# Altium project Compact Inverter Power.PrjPcb
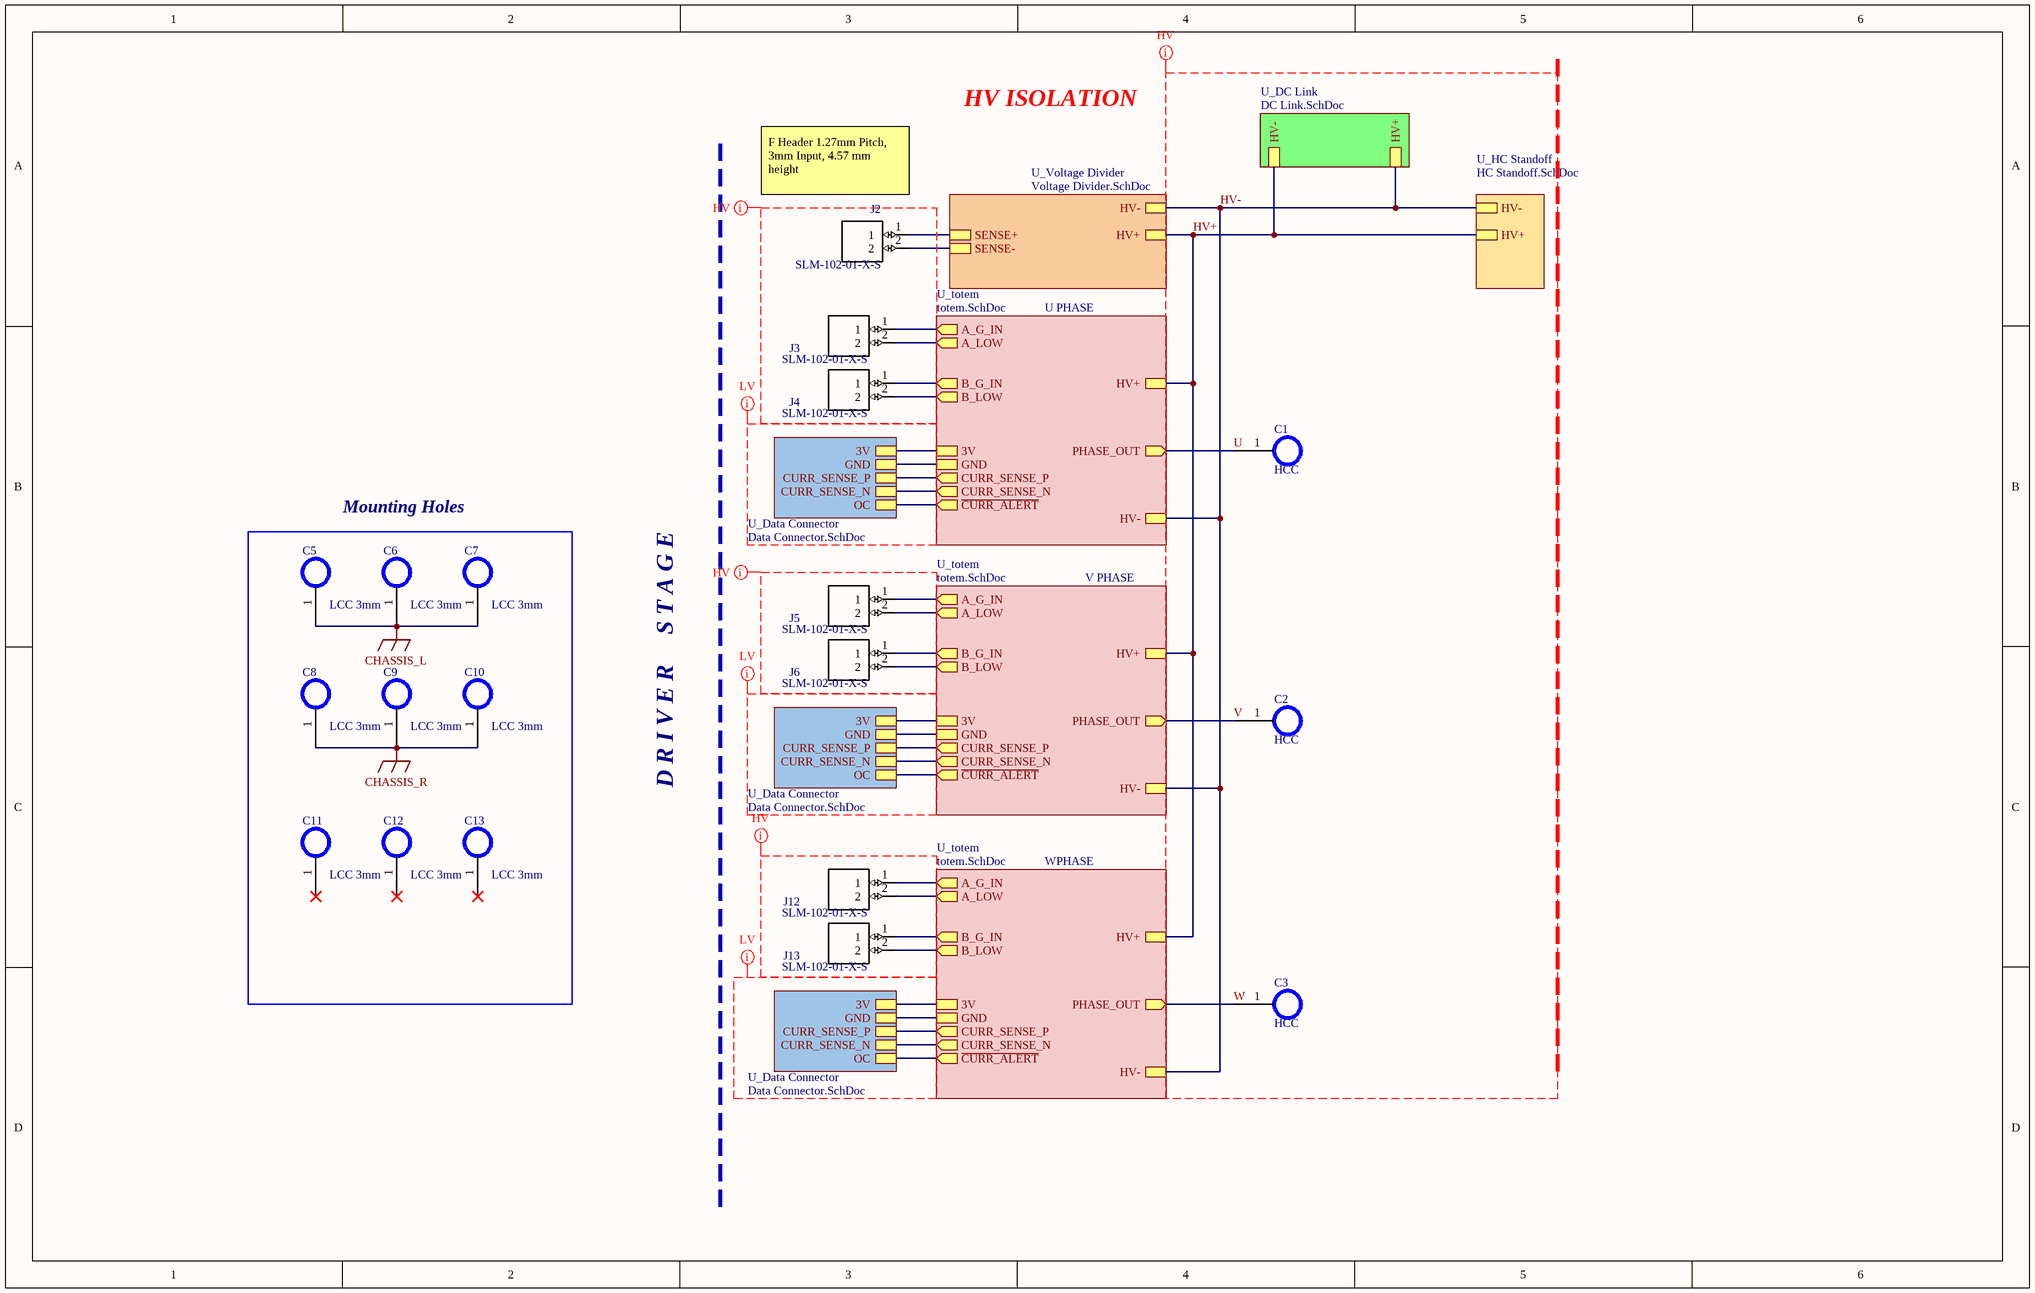
[diagram p0: Tree.SchDoc]
Model: 24
5 sheets, 78 parts. Net scope: strictly hierarchical (ports join the sheet entries above them; power ports are local).
Board file: PCB.PcbDoc
Sheets:
  Tree.SchDoc
    U_HC Standoff = HC Standoff.SchDoc
    U_DC Link = DC Link.SchDoc
    U_Data Connector = Data Connector.SchDoc
    U_totem = totem.SchDoc
    U_Data Connector = Data Connector.SchDoc
    U_totem = totem.SchDoc
    U_Data Connector = Data Connector.SchDoc
    U_totem = totem.SchDoc

## Sheet Tree.SchDoc
size B; SheetNumber: 1; SheetTotal: 6

### Parts
(Parts that share a designator on the sheet are numbered #1, #2 ... from top to bottom, then left to right.)
C1  HCC  [6mm Pad]
C2  HCC  [6mm Pad]
C3  HCC  [6mm Pad]
C5  LCC 3mm  [PAD 3MM]
C6  LCC 3mm  [PAD 3MM]
C7  LCC 3mm  [PAD 3MM]
C8  LCC 3mm  [PAD 3MM]
C9  LCC 3mm  [PAD 3MM]
C10  LCC 3mm  [PAD 3MM]
C11#1  LCC 3mm  [PAD 3MM]
C12#1  LCC 3mm  [PAD 3MM]
C13#1  LCC 3mm  [PAD 3MM]
J2  SLM-102-01-X-S  [*SLM-102-01-X-S]
J3  SLM-102-01-X-S  [*SLM-102-01-X-S]
J4  SLM-102-01-X-S  [*SLM-102-01-X-S]
J5  SLM-102-01-X-S  [*SLM-102-01-X-S]
J6  SLM-102-01-X-S  [*SLM-102-01-X-S]
J12  SLM-102-01-X-S  [*SLM-102-01-X-S]
J13  SLM-102-01-X-S  [*SLM-102-01-X-S]

### Blocks framed on the sheet
Mounting Holes: C5-C10 C11#1 C12#1 C13#1

### Sub-sheets
U_Data Connector = Data Connector.SchDoc: GND, OC, 3V, CURR_SENSE_P, CURR_SENSE_N
U_Data Connector = Data Connector.SchDoc: GND, OC, 3V, CURR_SENSE_P, CURR_SENSE_N
U_Data Connector = Data Connector.SchDoc: GND, OC, 3V, CURR_SENSE_P, CURR_SENSE_N
U_DC Link = DC Link.SchDoc: HV+, HV-
U_HC Standoff = HC Standoff.SchDoc: HV+, HV-
U_totem = totem.SchDoc: PHASE_OUT (out), B_LOW (out), B_G_IN (out), A_LOW (out), A_G_IN (out), ~{CURR_ALERT} (out), HV+, HV-, 3V, GND, CURR_SENSE_P (out), CURR_SENSE_N (out)
U_totem = totem.SchDoc: PHASE_OUT (out), B_LOW (out), B_G_IN (out), A_LOW (out), A_G_IN (out), ~{CURR_ALERT} (out), HV+, HV-, 3V, GND, CURR_SENSE_P (out), CURR_SENSE_N (out)
U_totem = totem.SchDoc: PHASE_OUT (out), B_LOW (out), B_G_IN (out), A_LOW (out), A_G_IN (out), ~{CURR_ALERT} (out), HV+, HV-, 3V, GND, CURR_SENSE_P (out), CURR_SENSE_N (out)
U_Voltage Divider = Voltage Divider.SchDoc (file not in this document): HV+, HV-, SENSE+, SENSE-  | ClassName: U PHASE

### Nets
3V: sheet U_Data Connector/3V, sheet U_totem/3V
3V: sheet U_Data Connector/3V, sheet U_totem/3V  [a separate net that carries the same name]
3V: sheet U_Data Connector/3V, sheet U_totem/3V  [a separate net that carries the same name]
CHASSIS_L: C5.1 C6.1 C7.1
CHASSIS_R: C8.1 C9.1 C10.1
GND: sheet U_Data Connector/GND, sheet U_totem/GND
GND: sheet U_Data Connector/GND, sheet U_totem/GND  [a separate net that carries the same name]
GND: sheet U_Data Connector/GND, sheet U_totem/GND  [a separate net that carries the same name]
~{OC_DET}: sheet U_Data Connector/OC, sheet U_totem/~{CURR_ALERT}
~{OC_DET}: sheet U_Data Connector/OC, sheet U_totem/~{CURR_ALERT}  [a separate net that carries the same name]
~{OC_DET}: sheet U_Data Connector/OC, sheet U_totem/~{CURR_ALERT}  [a separate net that carries the same name]
A_G_IN: J3.1 ; sheet U_totem/A_G_IN
A_G_IN: J5.1 ; sheet U_totem/A_G_IN  [a separate net that carries the same name]
A_G_IN: J12.1 ; sheet U_totem/A_G_IN  [a separate net that carries the same name]
A_LOW: J3.2 ; sheet U_totem/A_LOW
A_LOW: J5.2 ; sheet U_totem/A_LOW  [a separate net that carries the same name]
A_LOW: J12.2 ; sheet U_totem/A_LOW  [a separate net that carries the same name]
B_G_IN: J4.1 ; sheet U_totem/B_G_IN
B_G_IN: J6.1 ; sheet U_totem/B_G_IN  [a separate net that carries the same name]
B_G_IN: J13.1 ; sheet U_totem/B_G_IN  [a separate net that carries the same name]
B_LOW: J4.2 ; sheet U_totem/B_LOW
B_LOW: J6.2 ; sheet U_totem/B_LOW  [a separate net that carries the same name]
B_LOW: J13.2 ; sheet U_totem/B_LOW  [a separate net that carries the same name]
CURR_SENSE_N: sheet U_Data Connector/CURR_SENSE_N, sheet U_totem/CURR_SENSE_N
CURR_SENSE_N: sheet U_Data Connector/CURR_SENSE_N, sheet U_totem/CURR_SENSE_N  [a separate net that carries the same name]
CURR_SENSE_N: sheet U_Data Connector/CURR_SENSE_N, sheet U_totem/CURR_SENSE_N  [a separate net that carries the same name]
CURR_SENSE_P: sheet U_Data Connector/CURR_SENSE_P, sheet U_totem/CURR_SENSE_P
CURR_SENSE_P: sheet U_Data Connector/CURR_SENSE_P, sheet U_totem/CURR_SENSE_P  [a separate net that carries the same name]
CURR_SENSE_P: sheet U_Data Connector/CURR_SENSE_P, sheet U_totem/CURR_SENSE_P  [a separate net that carries the same name]
HV+: sheet U_HC Standoff/HV+, sheet U_Voltage Divider/HV+, sheet U_DC Link/HV-, sheet U_totem/HV+, sheet U_totem/HV+, sheet U_totem/HV+
HV-: sheet U_HC Standoff/HV-, sheet U_Voltage Divider/HV-, sheet U_DC Link/HV+, sheet U_totem/HV-, sheet U_totem/HV-, sheet U_totem/HV-
U: C1.1 ; sheet U_totem/PHASE_OUT
V: C2.1 ; sheet U_totem/PHASE_OUT
W: C3.1 ; sheet U_totem/PHASE_OUT
NetJ2_1: J2.1 ; sheet U_Voltage Divider/SENSE+
NetJ2_2: J2.2 ; sheet U_Voltage Divider/SENSE-

Not connected (* = marked no-connect by the designer): C11#1 1*; C12#1 1*; C13#1 1*

### Layout directives
net class HV: (no net found under the mark), HV+, HV-, U, V, W
net class LV: (no net found under the mark)

### Notes on the sheet
- HV ISOLATION
- (near J2) F Header 1.27mm Pitch, 3mm Input, 4.57 mm height
- U PHASE
- V PHASE
- D R I V E R     S T A G E
- WPHASE
- MY
- Project
- Author
- Revision
- Sheet
- Modified
- of

### Library data of the parts
J2-J6 J12 J13 = SLM-102-01-X-S: Value: *

## Sheet HC Standoff.SchDoc
size A; SheetNumber: 4; SheetTotal: 4
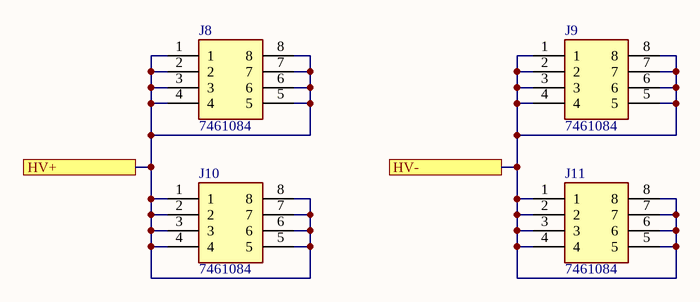
[diagram p1: HC Standoff.SchDoc]

### Parts
J8  7461084  [7461084]
J9  7461084  [7461084]
J10  7461084  [7461084]
J11  7461084  [7461084]

### Ports
HV+, HV-

### Nets
HV+: J8.1 J8.2 J8.3 J8.4 J8.5 J8.6 J8.7 J8.8 J10.1 J10.2 J10.3 J10.4 J10.5 J10.6 J10.7 J10.8 ; port HV+
HV-: J9.1 J9.2 J9.3 J9.4 J9.5 J9.6 J9.7 J9.8 J11.1 J11.2 J11.3 J11.4 J11.5 J11.6 J11.7 J11.8 ; port HV-

### Library data of the parts
J8-J11 = 7461084: Connector; Manufacturer_Name: Wurth Elektronik; Datasheet Link: https://www.we-online.com/components/products/datasheet/7461084.pdf; Height: 13.5mm; Manufacturer_Part_Number: 7461084; Mouser Part Number: 710-7461084; Mouser Price/Stock: https://www.mouser.co.uk/ProductDetail/Wurth-Elektronik/7461084?qs=lykWx4dhCCHlOeuPuO4BAQ%3D%3D

## Sheet DC Link.SchDoc
size A; SheetNumber: 6; SheetTotal: 7
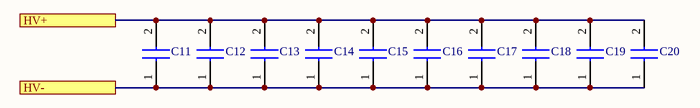
[diagram p2: DC Link.SchDoc]

### Parts
(Parts that share a designator on the sheet are numbered #1, #2 ... from top to bottom, then left to right.)
C11#2  B58031U9254M062  [B58031U9254M062]  (value not drawn)
C12#2  B58031U9254M062  [B58031U9254M062]  (value not drawn)
C13#2  B58031U9254M062  [B58031U9254M062]  (value not drawn)
C14  B58031U9254M062  [B58031U9254M062]  (value not drawn)
C15  B58031U9254M062  [B58031U9254M062]  (value not drawn)
C16  B58031U9254M062  [B58031U9254M062]  (value not drawn)
C17  B58031U9254M062  [B58031U9254M062]  (value not drawn)
C18  B58031U9254M062  [B58031U9254M062]  (value not drawn)
C19  B58031U9254M062  [B58031U9254M062]  (value not drawn)
C20  B58031U9254M062  [B58031U9254M062]  (value not drawn)

### Ports
HV+, HV-

### Nets
HV+: C11#2.1 C12#2.1 C13#2.1 C14.1 C15.1 C16.1 C17.1 C18.1 C19.1 C20.1 ; port HV-
HV-: C11#2.2 C12#2.2 C13#2.2 C14.2 C15.2 C16.2 C17.2 C18.2 C19.2 C20.2 ; port HV+

### Library data of the parts
C11#2 C12#2 C13#2 C14-C20 = B58031U9254M062: Capacitor; Manufacturer_Name: TDK; Datasheet Link: https://product.tdk.com/system/files/dam/doc/product/capacitor/ceramic/ceralink/data_sheet/20/10/ds/b58031_lp.pdf; Height: 4.5mm; Manufacturer_Part_Number: B58031U9254M062; Mouser Part Number: 871-B58031U9254M062; Mouser Price/Stock: https://www.mouser.co.uk/ProductDetail/EPCOS-TDK/B58031U9254M062?qs=Mv7BduZupUir5egwM6Ifng%3D%3D; Arrow Part Number: B58031U9254M062; Arrow Price/Stock: https://www.arrow.com/en/products/b58031u9254m062/tdk?region=europe

## Sheet Data Connector.SchDoc
size A; SheetNumber: 3; SheetTotal: 6
Used 3 times, as channels U_Data Connector, U_Data Connector, U_Data Connector. Parts and nets are listed once, with the designators drawn on the sheet.
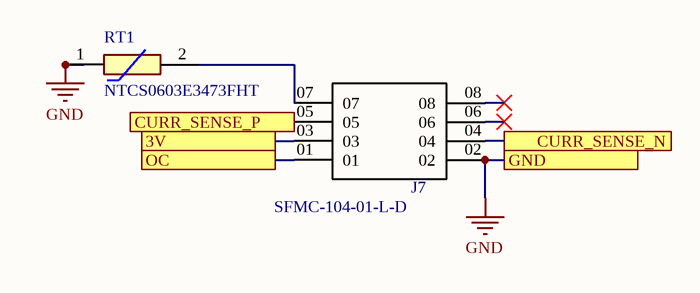
[diagram p3: Data Connector.SchDoc]

### Parts
J7  SFMC-104-01-L-D  [*SAMTEC_SFMC-104-01-L-D_SFMC-104-01-L-D(Primary)]
RT1  NTCS0603E3473FHT  [THRMC1608X95N]

### Ports
3V, CURR_SENSE_N, CURR_SENSE_P, GND, OC

### Nets
GND: J7.02 RT1.1 ; port GND
3V: J7.03 ; port 3V
CURR_SENSE_N: J7.04 ; port CURR_SENSE_N
CURR_SENSE_P: J7.05 ; port CURR_SENSE_P
OC: J7.01 ; port OC
NetJ7_07: J7.07 RT1.2

Not connected (* = marked no-connect by the designer): J7 06* 08*

### Channels
U_Data Connector: designators end in _U_Data_Connector#1; ports 3V=3V CURR_SENSE_N=CURR_SENSE_N CURR_SENSE_P=CURR_SENSE_P GND=GND OC=~{OC_DET}
U_Data Connector: designators end in _U_Data_Connector#2; ports 3V=3V CURR_SENSE_N=CURR_SENSE_N CURR_SENSE_P=CURR_SENSE_P GND=GND OC=~{OC_DET}
U_Data Connector: designators end in _U_Data_Connector#3; ports 3V=3V CURR_SENSE_N=CURR_SENSE_N CURR_SENSE_P=CURR_SENSE_P GND=GND OC=~{OC_DET}

### Library data of the parts
RT1 = NTCS0603E3473FHT: Thermistor; Manufacturer_Name: Vishay; Datasheet Link: https://datasheet.datasheetarchive.com/originals/distributors/Datasheets-DGA6/547972.pdf; Height: 0.95mm; Manufacturer_Part_Number: NTCS0603E3473FHT; Mouser Part Number: 594-NTCS0603E3473FHT; Mouser Price/Stock: https://www.mouser.co.uk/ProductDetail/Vishay-BC-Components/NTCS0603E3473FHT?qs=%2FWiulJ9oly5JyPnR8jCnHg%3D%3D; Arrow Part Number: NTCS0603E3473FHT; Arrow Price/Stock: https://www.arrow.com/en/products/ntcs0603e3473fht/vishay
J7 = SFMC-104-01-L-D: Value: *

## Sheet totem.SchDoc
size A4; SheetNumber: 2; SheetTotal: 6
Used 3 times, as channels U_totem, U_totem, U_totem. Parts and nets are listed once, with the designators drawn on the sheet.
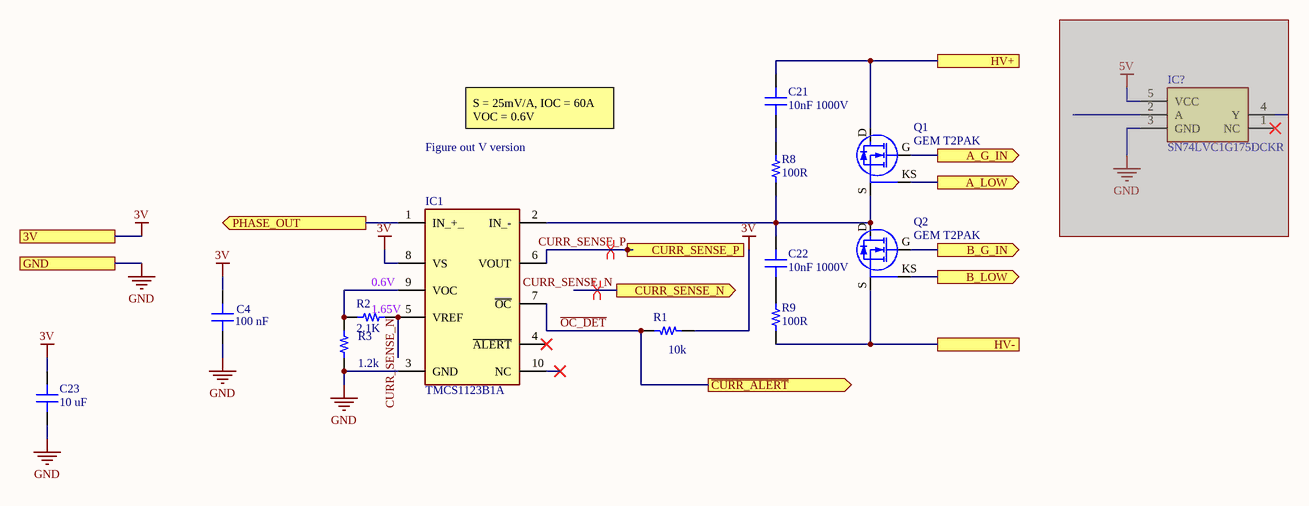
[diagram p4: totem.SchDoc]

### Parts
C4  Capacitance: 100 nF  [CAP 0603_1608]  (hidden comment: 20 pF)
C21  10nF 1000V  [CAP 1206_3216 - 0.8MM]
C22  10nF 1000V  [CAP 1206_3216 - 0.8MM]
C23  Capacitance: 10 uF  [CAP 0603_1608]  (hidden comment: 20 pF)
IC1  TMCS1123B1A  [TMCS1126A8AQDVGRQ1]
IC?  SN74LVC1G175DCKR  [SOP65P210X110-6N]  (masked out: inside a compile mask, not in the netlist)
Q1  GEM T2PAK  [GEM T2PAK H3.6]
Q2  GEM T2PAK  [GEM T2PAK H3.6]
R1  10k  [RES 0603_1608]
R2  2.1K  [RES 0603_1608]
R3  1.2k  [RES 0603_1608]
R8  100R  [RES 1206_3216]
R9  100R  [RES 1206_3216]

### Ports
3V, A_G_IN (out), A_LOW (out), B_G_IN (out), B_LOW (out), CURR_SENSE_N (out), CURR_SENSE_P (out), GND, HV+, HV-, PHASE_OUT (out), ~{CURR_ALERT} (out)

### Nets
3V: C4.1 C23.1 IC1.8(VS) R1.2 ; port 3V
GND: C4.2 C23.2 IC1.3(GND) R3.2 ; port GND
~{OC_DET}: IC1.7(~{OC}) R1.1 ; port ~{CURR_ALERT}
A_G_IN: Q1.G ; port A_G_IN
A_LOW: Q1.KS ; port A_LOW
B_G_IN: Q2.G ; port B_G_IN
B_LOW: Q2.KS ; port B_LOW
CURR_SENSE_N: IC1.5(VREF) R2.2 ; port CURR_SENSE_N
CURR_SENSE_P: IC1.6(VOUT) ; port CURR_SENSE_P
HV+: C21.2 Q1.D ; port HV+
HV-: Q2.S R9.1 ; port HV-
PHASE_OUT: IC1.1(IN_+_) ; port PHASE_OUT
NetC21_1: C21.1 R8.2
NetC22_1: C22.1 R9.2
NetC22_2: C22.2 IC1.2(IN_-) Q1.S Q2.D R8.1
NetIC1_9: IC1.9(VOC) R2.1 R3.1

Not connected (* = marked no-connect by the designer): IC1 4(~{ALERT})* 10(NC)*

### Channels
U_totem: designators end in _U_totem#1; ports 3V=3V A_G_IN=A_G_IN A_LOW=A_LOW B_G_IN=B_G_IN B_LOW=B_LOW CURR_SENSE_N=CURR_SENSE_N CURR_SENSE_P=CURR_SENSE_P GND=GND HV+=HV+ HV-=HV- PHASE_OUT=U ~{CURR_ALERT}=~{OC_DET}
U_totem: designators end in _U_totem#2; ports 3V=3V A_G_IN=A_G_IN A_LOW=A_LOW B_G_IN=B_G_IN B_LOW=B_LOW CURR_SENSE_N=CURR_SENSE_N CURR_SENSE_P=CURR_SENSE_P GND=GND HV+=HV+ HV-=HV- PHASE_OUT=V ~{CURR_ALERT}=~{OC_DET}
U_totem: designators end in _U_totem#3; ports 3V=3V A_G_IN=A_G_IN A_LOW=A_LOW B_G_IN=B_G_IN B_LOW=B_LOW CURR_SENSE_N=CURR_SENSE_N CURR_SENSE_P=CURR_SENSE_P GND=GND HV+=HV+ HV-=HV- PHASE_OUT=W ~{CURR_ALERT}=~{OC_DET}

### Layout directives
differential pair: CURR_SENSE_N, CURR_SENSE_P

### Notes on the sheet
- S = 25mV/A, IOC = 60A
  VOC = 0.6V
- Figure out V version
- (near R2) 1.65V
- 0.6V
- MY
- 25
- Project:
- Author
- Revision
- Sheet
- Modified
- of

### Library data of the parts
C4 C23 = C0603C200K5GAC7867: CAP CER 20PF 50V NP0 0603; manufacturer: KEMET; Temperature Coefficient: C0G, NP0; Tolerance: ±10%; Part Number: C0603C200K5GAC7867; Applications: General Purpose; componentlink1description: Datasheet; componentlink1url: https://api.kemet.com/component-edge/download/datasheet/C0603C200K5GACTU.pdf; componentlink2description: DigiKey Link; componentlink2url: https://www.digikey.com/en/products/detail/kemet/C0603C200K5GAC7867/2200149; Device Package: 0603 (1608 Metric); Features: Low ESL; lastupdated: 2/9/2024 8:10:26 PM; Lifecycle Status: Active; Minimum Order: 1; Mounting Type: Surface Mount, MLCC; Operating Temperature: -55°C ~ 125°C; Package / Case: 0603 (1608 Metric); packaging: TapeAndReel; partid: 5330; Part Status: Active; price: 0.04; series: SMD Comm C0G; Size / Dimension: 0.063" L x 0.031" W (1.60mm x 0.80mm); Supplier 1: DigiKey; Supplier Part Number 1: 399-17401-1-ND; Thickness (Max): 0.034" (0.87mm); value: 20 pF; Voltage - Rated: 50V
C21 C22 = MM062C102KCZ2A: CAP CER 1000PF 200V X7R 1206; manufacturer: AVX Corporation; Tolerance: ±10%; Part Number: MM062C102KCZ2A; Capacitance: 1000pF; Applications: Medical, Non-Critical; componentlink1description: Datasheet; componentlink1url: http://datasheets.avx.com/AVX-MM.pdf; componentlink2description: DigiKey Link; componentlink2url: http://digikey.com/product-detail/en/avx-corporation/MM062C102KCZ2A/478-10625-1-ND/7344886; Device Package: 1206 (3216 Metric); lastupdated: 9/2/2020 1:04:46 AM; Lifecycle Status: Active; Minimum Order: 1; Mounting Type: Surface Mount, MLCC; Operating Temperature: -55°C ~ 125°C; Package / Case: 1206 (3216 Metric); packaging: TapeAndReel; partid: 18686; Part Status: Active; price: 0.57; series: MM; Size / Dimension: 0.126" L x 0.063" W (3.20mm x 1.60mm); Supplier 1: DigiKey; Supplier Part Number 1: 478-10625-1-ND; Temperature Coefficient: X7R; Thickness (Max): 0.029" (0.74mm); value: 1000pF; Voltage - Rated: 200V
IC1 = TMCS1123A1AQDVGR: Integrated Circuit; Manufacturer_Name: Texas Instruments; Datasheet Link: https://www.ti.com/lit/ds/symlink/tmcs1123.pdf?ts=1707973672803&ref_url=https%253A%252F%252Fwww.google.com%252F; Height: 2.65mm; Manufacturer_Part_Number: TMCS1123A1AQDVGR; Mouser Part Number: 595-TMCS1123A1AQDVGR; Mouser Price/Stock: https://www.mouser.co.uk/ProductDetail/Texas-Instruments/TMCS1123A1AQDVGR?qs=mELouGlnn3ezMP2QpzrvaA%3D%3D; Arrow Part Number: TMCS1123A1AQDVGR; Arrow Price/Stock: https://www.arrow.com/en/products/tmcs1123a1aqdvgr/texas-instruments?region=nac
IC? = SN74LVC1G175DCKR: Integrated Circuit; Manufacturer_Name: Texas Instruments; Datasheet Link: http://www.ti.com/lit/gpn/sn74lvc1g175; Height: 1.1mm; Manufacturer_Part_Number: SN74LVC1G175DCKR; Mouser Part Number: 595-SN74LVC1G175DCKR; Mouser Price/Stock: https://www.mouser.co.uk/ProductDetail/Texas-Instruments/SN74LVC1G175DCKR?qs=pajgIaoyDUjI2BH1x6CpqQ%3D%3D; Arrow Part Number: SN74LVC1G175DCKR; Arrow Price/Stock: https://www.arrow.com/en/products/sn74lvc1g175dckr/texas-instruments?region=nac
R1 = RNCS0603BKE10K0: RES 10K OHM 0.1% 1/16W 0603; Manufacturer: Stackpole Electronics Inc; Value: 1k; Power (Watts): 0.063W, 1/16W; Resistance: 10 kOhms; Temperature Coefficient: ±25ppm/°C; Part Number: RNCS0603BKE10K0; ComponentLink1Description: Datasheet; ComponentLink1URL: https://www.seielect.com/catalog/sei-rncs_rnch.pdf; ComponentLink2Description: DigiKey Link; ComponentLink2URL: https://www.digikey.com/en/products/detail/stackpole-electronics-inc/RNCS0603BKE10K0/1708836; Composition: Thin Film; Device Package: 0603 (1608 Metric); Features: Anti-Corrosive, Automotive AEC-Q200, Moisture Resistant; Height - Seated (Max): 0.022" (0.55mm); LastUpdated: 2/9/2024 8:43:37 PM; Lifecycle Status: Active; Minimum Order: 1; Number of Terminations: 2; Operating Temperature: -55°C ~ 155°C; Package / Case: 0603 (1608 Metric); Packaging: TapeAndReel; PartId: 4838; Part Status: Active; Price: 0.06; Ratings: AEC-Q200; Series: RNCS; Size / Dimension: 0.061" L x 0.031" W (1.55mm x 0.80mm); Supplier 1: DigiKey; Supplier Part Number 1: RNCS0603BKE10K0CT-ND; Supplier Device Package: 0603; Tolerance: ±0.1%
R2 = RNCS0603BKE7K50: RES 7.5K OHM 0.1% 1/16W 0603; Manufacturer: Stackpole Electronics Inc; Power (Watts): 0.063W, 1/16W; Resistance: 7.5 kOhms; Temperature Coefficient: ±25ppm/°C; Part Number: RNCS0603BKE7K50; Value: 2.1K; ComponentLink1Description: Datasheet; ComponentLink1URL: https://www.seielect.com/catalog/sei-rncs_rnch.pdf; ComponentLink2Description: DigiKey Link; ComponentLink2URL: https://www.digikey.com/en/products/detail/stackpole-electronics-inc/RNCS0603BKE7K50/1800055; Composition: Thin Film; Device Package: 0603 (1608 Metric); Features: Anti-Corrosive, Automotive AEC-Q200, Moisture Resistant; Height - Seated (Max): 0.022" (0.55mm); LastUpdated: 2/9/2024 8:43:37 PM; Lifecycle Status: Active; Minimum Order: 1; Number of Terminations: 2; Operating Temperature: -55°C ~ 155°C; Package / Case: 0603 (1608 Metric); Packaging: TapeAndReel; PartId: 4846; Part Status: Active; Price: 0.06; Ratings: AEC-Q200; Series: RNCS; Size / Dimension: 0.061" L x 0.031" W (1.55mm x 0.80mm); Supplier 1: DigiKey; Supplier Part Number 1: RNCS0603BKE7K50CT-ND; Supplier Device Package: 0603; Tolerance: ±0.1%
R3 = RNCS0603BKE10K0: RES 10K OHM 0.1% 1/16W 0603; Manufacturer: Stackpole Electronics Inc; Power (Watts): 0.063W, 1/16W; Resistance: 10 kOhms; Temperature Coefficient: ±25ppm/°C; Part Number: RNCS0603BKE10K0; Value: 10k; ComponentLink1Description: Datasheet; ComponentLink1URL: https://www.seielect.com/catalog/sei-rncs_rnch.pdf; ComponentLink2Description: DigiKey Link; ComponentLink2URL: https://www.digikey.com/en/products/detail/stackpole-electronics-inc/RNCS0603BKE10K0/1708836; Composition: Thin Film; Device Package: 0603 (1608 Metric); Features: Anti-Corrosive, Automotive AEC-Q200, Moisture Resistant; Height - Seated (Max): 0.022" (0.55mm); LastUpdated: 2/9/2024 8:43:37 PM; Lifecycle Status: Active; Minimum Order: 1; Number of Terminations: 2; Operating Temperature: -55°C ~ 155°C; Package / Case: 0603 (1608 Metric); Packaging: TapeAndReel; PartId: 4838; Part Status: Active; Price: 0.06; Ratings: AEC-Q200; Series: RNCS; Size / Dimension: 0.061" L x 0.031" W (1.55mm x 0.80mm); Supplier 1: DigiKey; Supplier Part Number 1: RNCS0603BKE10K0CT-ND; Supplier Device Package: 0603; Tolerance: ±0.1%
R8 R9 = Y4063100R000A0R: RES SMD 100 OHM 0.05% 1/2W 1206; Manufacturer: Vishay Foil Resistors (Division of Vishay Precision Group); Power (Watts): 0.5W, 1/2W; Resistance: 100 Ohms; Temperature Coefficient: ±2.5ppm/°C; Value: 100 Ohms; Part Number: Y4063100R000A0R; ComponentLink1Description: Datasheet; ComponentLink1URL: http://www.vishaypg.com/docs/63211/FRSHZ.pdf; ComponentLink2Description: DigiKey Link; ComponentLink2URL: https://www.digikey.com/en/products/detail/vishay-foil-resistors-division-of-vishay-precision-group/Y4063100R000A0R/3046987; Composition: Metal Foil; Device Package: 1206 (3216 Metric); Features: Moisture Resistant, Non-Inductive; Height - Seated (Max): 0.025" (0.64mm); LastUpdated: 2/9/2024 8:54:29 PM; Lifecycle Status: Active; Minimum Order: 1; Number of Terminations: 2; Operating Temperature: -55°C ~ 225°C; Package / Case: 1206 (3216 Metric); Packaging: TapeAndReel; PartId: 30795; Part Status: Active; Price: 12.79; Series: FRSH; Size / Dimension: 0.126" L x 0.062" W (3.20mm x 1.57mm); Supplier 1: DigiKey; Supplier Part Number 1: Y4063-100ACT-ND; Supplier Device Package: 1206; Tolerance: ±0.05%

## Nets that join several sheets
3V: U_Data Connector (J7_U_Data_Connector#1.03), U_totem (C4_U_totem#1.1 C23_U_totem#1.1 IC1_U_totem#1.8 R1_U_totem#1.2)
3V: U_Data Connector (J7_U_Data_Connector#2.03), U_totem (C4_U_totem#2.1 C23_U_totem#2.1 IC1_U_totem#2.8 R1_U_totem#2.2)
3V: U_Data Connector (J7_U_Data_Connector#3.03), U_totem (C4_U_totem#3.1 C23_U_totem#3.1 IC1_U_totem#3.8 R1_U_totem#3.2)
GND: U_Data Connector (J7_U_Data_Connector#1.02 RT1_U_Data_Connector#1.1), U_totem (C4_U_totem#1.2 C23_U_totem#1.2 IC1_U_totem#1.3 R3_U_totem#1.2)
GND: U_Data Connector (J7_U_Data_Connector#2.02 RT1_U_Data_Connector#2.1), U_totem (C4_U_totem#2.2 C23_U_totem#2.2 IC1_U_totem#2.3 R3_U_totem#2.2)
GND: U_Data Connector (J7_U_Data_Connector#3.02 RT1_U_Data_Connector#3.1), U_totem (C4_U_totem#3.2 C23_U_totem#3.2 IC1_U_totem#3.3 R3_U_totem#3.2)
~{OC_DET}: U_Data Connector (J7_U_Data_Connector#1.01), U_totem (IC1_U_totem#1.7 R1_U_totem#1.1)
~{OC_DET}: U_Data Connector (J7_U_Data_Connector#2.01), U_totem (IC1_U_totem#2.7 R1_U_totem#2.1)
~{OC_DET}: U_Data Connector (J7_U_Data_Connector#3.01), U_totem (IC1_U_totem#3.7 R1_U_totem#3.1)
A_G_IN: Tree (J3.1), U_totem (Q1_U_totem#1.G)
A_G_IN: Tree (J5.1), U_totem (Q1_U_totem#2.G)
A_G_IN: Tree (J12.1), U_totem (Q1_U_totem#3.G)
A_LOW: Tree (J3.2), U_totem (Q1_U_totem#1.KS)
A_LOW: Tree (J5.2), U_totem (Q1_U_totem#2.KS)
A_LOW: Tree (J12.2), U_totem (Q1_U_totem#3.KS)
B_G_IN: Tree (J4.1), U_totem (Q2_U_totem#1.G)
B_G_IN: Tree (J6.1), U_totem (Q2_U_totem#2.G)
B_G_IN: Tree (J13.1), U_totem (Q2_U_totem#3.G)
B_LOW: Tree (J4.2), U_totem (Q2_U_totem#1.KS)
B_LOW: Tree (J6.2), U_totem (Q2_U_totem#2.KS)
B_LOW: Tree (J13.2), U_totem (Q2_U_totem#3.KS)
CURR_SENSE_N: U_Data Connector (J7_U_Data_Connector#1.04), U_totem (IC1_U_totem#1.5 R2_U_totem#1.2)
CURR_SENSE_N: U_Data Connector (J7_U_Data_Connector#2.04), U_totem (IC1_U_totem#2.5 R2_U_totem#2.2)
CURR_SENSE_N: U_Data Connector (J7_U_Data_Connector#3.04), U_totem (IC1_U_totem#3.5 R2_U_totem#3.2)
CURR_SENSE_P: U_Data Connector (J7_U_Data_Connector#1.05), U_totem (IC1_U_totem#1.6)
CURR_SENSE_P: U_Data Connector (J7_U_Data_Connector#2.05), U_totem (IC1_U_totem#2.6)
CURR_SENSE_P: U_Data Connector (J7_U_Data_Connector#3.05), U_totem (IC1_U_totem#3.6)
HV+: HC Standoff (16 pins), DC Link (10 pins), U_totem (C21_U_totem#1.2 Q1_U_totem#1.D), U_totem (C21_U_totem#2.2 Q1_U_totem#2.D), U_totem (C21_U_totem#3.2 Q1_U_totem#3.D)
HV-: HC Standoff (16 pins), DC Link (10 pins), U_totem (Q2_U_totem#1.S R9_U_totem#1.1), U_totem (Q2_U_totem#2.S R9_U_totem#2.1), U_totem (Q2_U_totem#3.S R9_U_totem#3.1)
U: Tree (C1.1), U_totem (IC1_U_totem#1.1)
V: Tree (C2.1), U_totem (IC1_U_totem#2.1)
W: Tree (C3.1), U_totem (IC1_U_totem#3.1)